# Altium schematic sheet PULLDNx3.SCHDOC: Visual Indicators Top
size A4; DocumentNumber: 10; SheetNumber: 11; SheetTotal: 78
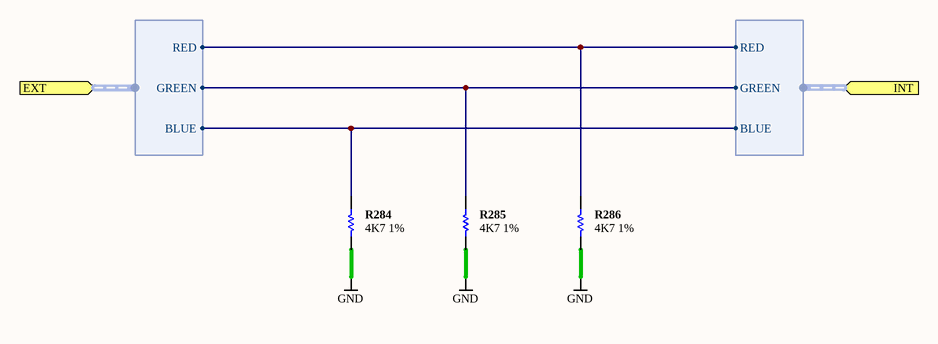
[diagram p0: PULLDNx3.SCHDOC]

## Parts
R284  4K7 1%  [RESC1005-STAR]
R285  4K7 1%  [RESC1005-STAR]
R286  4K7 1%  [RESC1005-STAR]

## Ports
EXT (harness RGB_LED), INT (harness RGB_LED)

## Harnesses
RGB_LED: GREEN, RED, BLUE

## Nets
GND: R284.1 R285.1 R286.1
NetR284_2: R284.2 ; port EXT.BLUE, port INT.BLUE
NetR285_2: R285.2 ; port EXT.GREEN, port INT.GREEN
NetR286_2: R286.2 ; port EXT.RED, port INT.RED

## Notes on the sheet
- Sheet Title
- Project Title
- Size:
- Date:
- A4
- Assy:
- Time:
- Revision:
- Sheet
- of
- File:

## Library data of the parts
R284-R286 = D-100-0088: Resistor, 4K7 1% 0402 (1005); Power Rating: 63 mW; Resistance: 4.7 K; Category: Resistor; Mounting Technology: Surface Mount; Status: Production; Tolerance: 1 %